# Altium schematic sheet TOP_Schematic.SchDoc
size A4
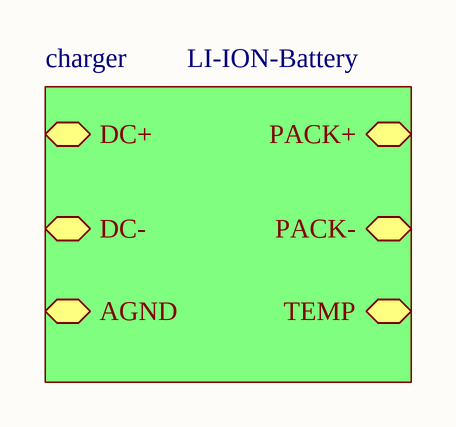
[diagram p0: TOP_Schematic.SchDoc]

## Sub-sheets
charger = LI-ION-Battery: DC+, DC-, PACK+, PACK-, AGND, TEMP